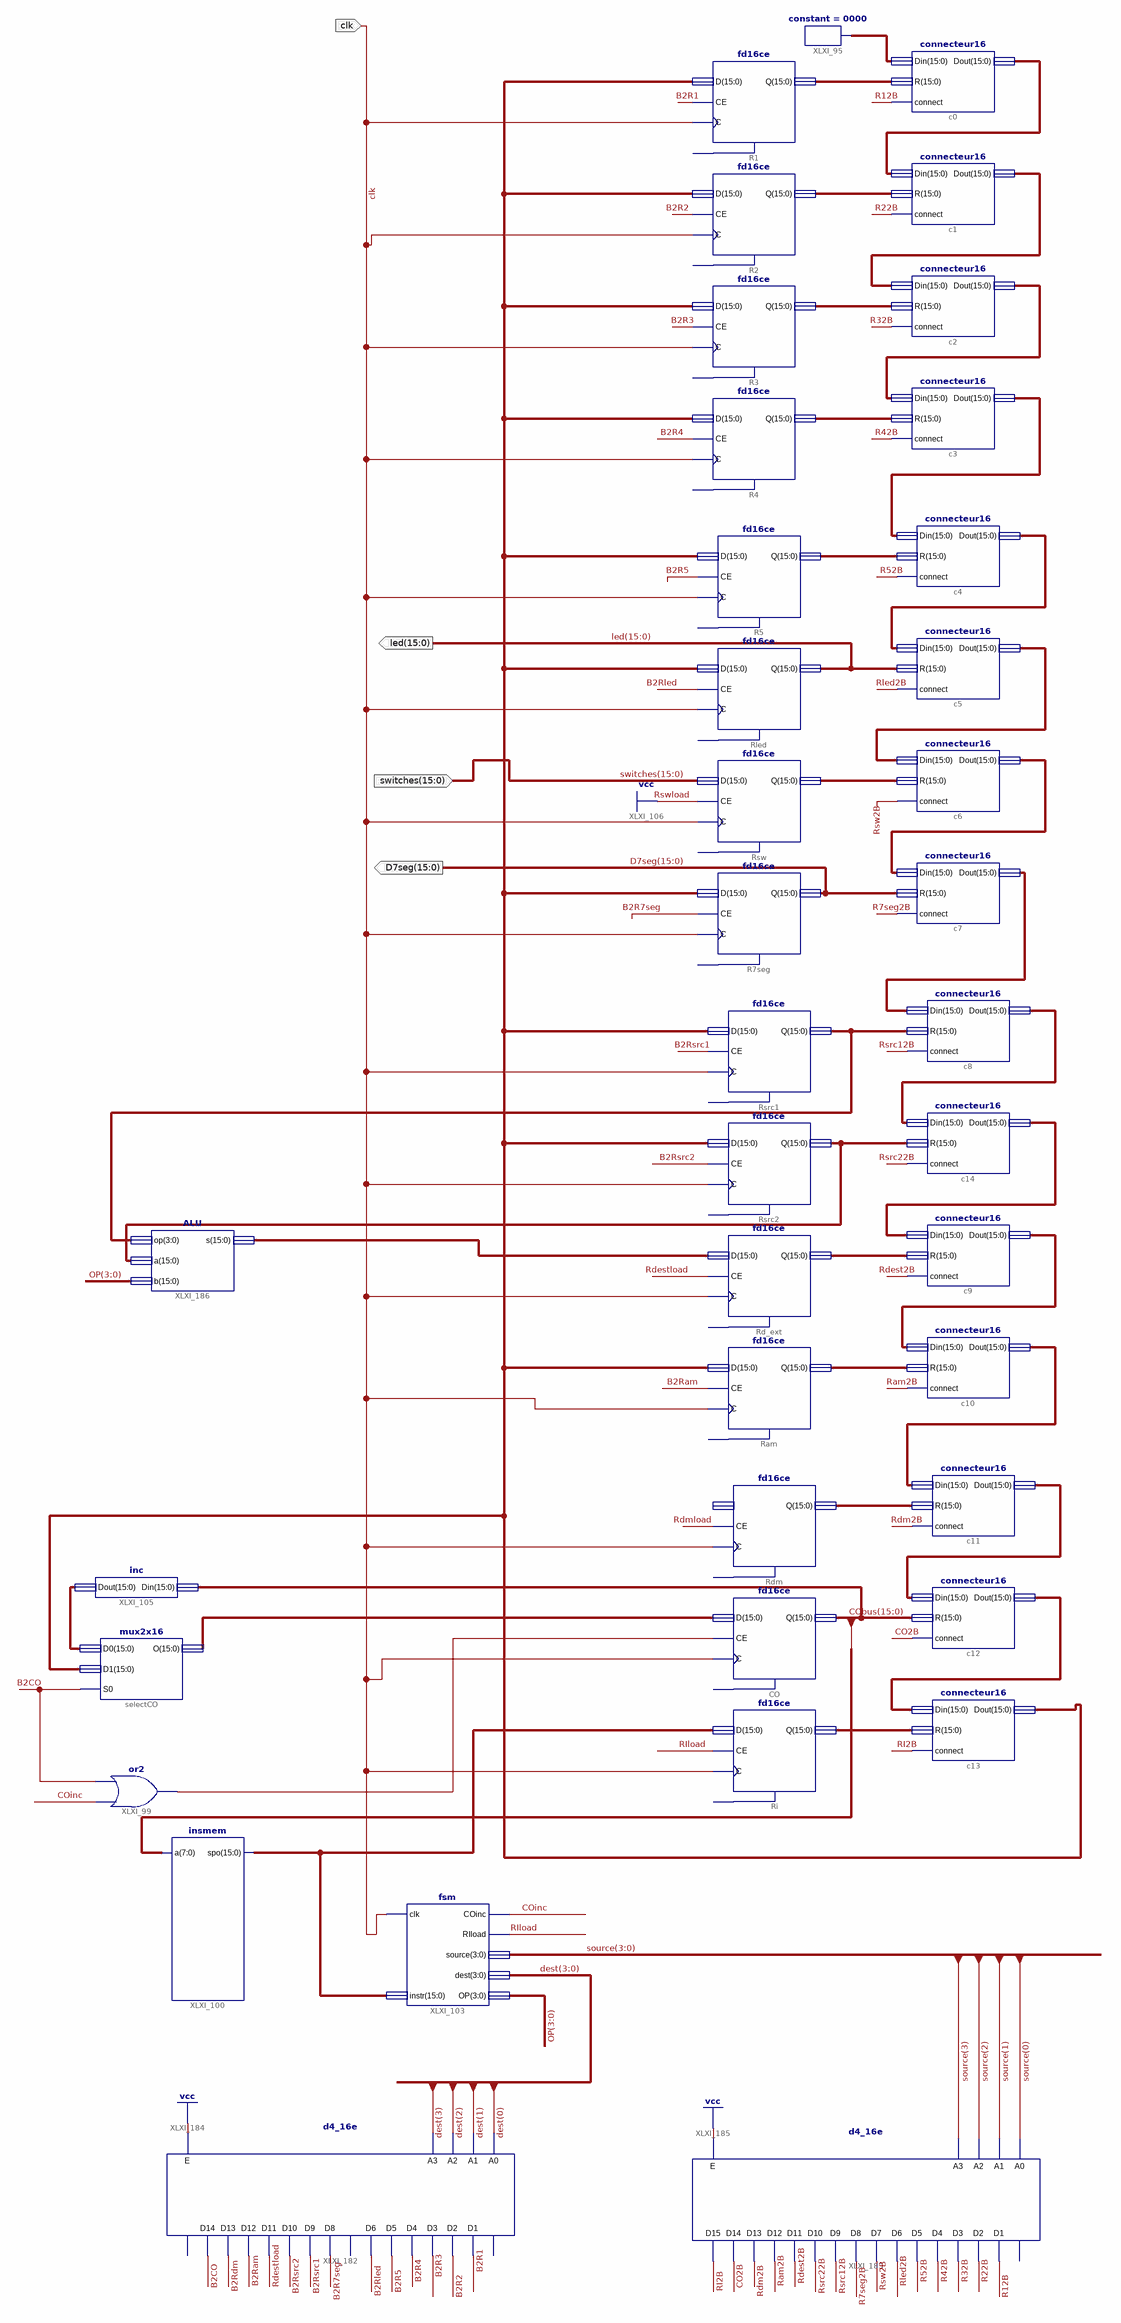
[diagram p0: schematic sheet 1]
// Xilinx ISE schematic S3.sch (spartan3e) as structural Verilog: 39 symbols, 4 ports
module S3 (
  input  [15:0] switches,
  input  clk,
  output [15:0] led,
  output [15:0] D7seg
);

  wire B2CO, B2R1, B2R2, B2R3, B2R4, B2R5, B2R7seg, B2Ram, B2Rdm, B2Rled, B2Rsrc1, B2Rsrc2, CO2B, COinc,
       R7seg2B, R12B, R22B, R32B, R42B, R52B, Ram2B, Rdest2B, Rdestload, Rdm2B, Rdmload, RI2B, RIload,
       Rled2B, Rsrc12B, Rsrc22B, Rsw2B, XLXN_133;
  wire [3:0] dest, OP, source;
  wire [15:0] CObus, R3out, R4out2, R7segout2, Rdextout2, Rdmout, Rsrc1out2, Rsrc2out, XLXN_1, XLXN_3,
       XLXN_5, XLXN_8, XLXN_10, XLXN_13, XLXN_15, XLXN_19, XLXN_21, XLXN_25, XLXN_27, XLXN_33, XLXN_34,
       XLXN_36, XLXN_40, XLXN_48, XLXN_51, XLXN_54, XLXN_57, XLXN_115, XLXN_119, XLXN_131, XLXN_134,
       XLXN_666, XLXN_863;

  fd16ce R1 (.C(clk), .CE(B2R1), .D(XLXN_119), .Q(XLXN_1));  // open: CLR
  connecteur16 c0 (.Din(XLXN_115), .R(XLXN_1), .connect(R12B), .Dout(XLXN_5));
  fd16ce R2 (.C(clk), .CE(B2R2), .D(XLXN_119), .Q(XLXN_3));  // open: CLR
  connecteur16 c1 (.Din(XLXN_5), .R(XLXN_3), .connect(R22B), .Dout(XLXN_13));
  fd16ce R3 (.C(clk), .CE(B2R3), .D(XLXN_119), .Q(R3out));  // open: CLR
  connecteur16 c2 (.Din(XLXN_13), .R(R3out), .connect(R32B), .Dout(XLXN_10));
  fd16ce R4 (.C(clk), .CE(B2R4), .D(XLXN_119), .Q(XLXN_8));  // open: CLR
  connecteur16 c3 (.Din(XLXN_10), .R(XLXN_8), .connect(R42B), .Dout(R4out2));
  fd16ce R5 (.C(clk), .CE(B2R5), .D(XLXN_119), .Q(XLXN_15));  // open: CLR
  connecteur16 c4 (.Din(R4out2), .R(XLXN_15), .connect(R52B), .Dout(XLXN_19));
  fd16ce Rled (.C(clk), .CE(B2Rled), .D(XLXN_119), .Q(led));  // open: CLR
  connecteur16 c5 (.Din(XLXN_19), .R(led), .connect(Rled2B), .Dout(XLXN_27));
  fd16ce Rsw (.C(clk), .CE(1'b1), .D(switches), .Q(XLXN_21));  // open: CLR
  connecteur16 c6 (.Din(XLXN_27), .R(XLXN_21), .connect(Rsw2B), .Dout(XLXN_25));
  fd16ce R7seg (.C(clk), .CE(B2R7seg), .D(XLXN_119), .Q(D7seg));  // open: CLR
  connecteur16 c7 (.Din(XLXN_25), .R(D7seg), .connect(R7seg2B), .Dout(R7segout2));
  fd16ce Rsrc1 (.C(clk), .CE(B2Rsrc1), .D(XLXN_119), .Q(XLXN_33));  // open: CLR
  connecteur16 c8 (.Din(R7segout2), .R(XLXN_33), .connect(Rsrc12B), .Dout(Rsrc1out2));
  fd16ce Rsrc2 (.C(clk), .CE(B2Rsrc2), .D(XLXN_119), .Q(Rsrc2out));  // open: CLR
  connecteur16 c14 (.Din(Rsrc1out2), .R(Rsrc2out), .connect(Rsrc22B), .Dout(XLXN_40));
  fd16ce Rd_ext (.C(clk), .CE(Rdestload), .D(XLXN_863), .Q(XLXN_34));  // open: CLR
  connecteur16 c9 (.Din(XLXN_40), .R(XLXN_34), .connect(Rdest2B), .Dout(Rdextout2));
  fd16ce Ram (.C(clk), .CE(B2Ram), .D(XLXN_119), .Q(XLXN_36));  // open: CLR
  connecteur16 c10 (.Din(Rdextout2), .R(XLXN_36), .connect(Ram2B), .Dout(XLXN_57));
  fd16ce Rdm (.C(clk), .CE(Rdmload), .Q(Rdmout));  // open: CLR, D
  connecteur16 c11 (.Din(XLXN_57), .R(Rdmout), .connect(Rdm2B), .Dout(XLXN_51));
  fd16ce CO (.C(clk), .CE(XLXN_133), .D(XLXN_131), .Q(CObus));  // open: CLR
  connecteur16 c12 (.Din(XLXN_51), .R(CObus), .connect(CO2B), .Dout(XLXN_54));
  fd16ce Ri (.C(clk), .CE(RIload), .D(XLXN_134), .Q(XLXN_48));  // open: CLR
  connecteur16 c13 (.Din(XLXN_54), .R(XLXN_48), .connect(RI2B), .Dout(XLXN_119));
  constant #(.CValue("0000")) XLXI_95 (.O(XLXN_115));
  mux2x16 selectCO (.D0(XLXN_666), .D1(XLXN_119), .S0(B2CO), .O(XLXN_131));
  or XLXI_99 (XLXN_133, COinc, B2CO);
  insmem XLXI_100 (.a(CObus[7:0]), .spo(XLXN_134));
  inc XLXI_105 (.Din(CObus), .Dout(XLXN_666));
  fsm XLXI_103 (.clk(clk), .instr(XLXN_134), .COinc(COinc), .RIload(RIload), .source(source), .dest(dest), .OP(OP));
  d4_16e XLXI_182 (
    .A0(dest[0]), .A1(dest[1]), .A2(dest[2]), .A3(dest[3]), .E(1'b1), .D1(B2R1), .D10(B2Rsrc2),
    .D11(Rdestload), .D12(B2Ram), .D13(B2Rdm), .D14(B2CO), .D2(B2R2), .D3(B2R3), .D4(B2R4), .D5(B2R5),
    .D6(B2Rled), .D8(B2R7seg), .D9(B2Rsrc1));  // open: D0, D15, D7
  d4_16e XLXI_183 (
    .A0(source[0]), .A1(source[1]), .A2(source[2]), .A3(source[3]), .E(1'b1), .D1(R12B), .D10(Rsrc22B),
    .D11(Rdest2B), .D12(Ram2B), .D13(Rdm2B), .D14(CO2B), .D15(RI2B), .D2(R22B), .D3(R32B), .D4(R42B),
    .D5(R52B), .D6(Rled2B), .D7(Rsw2B), .D8(R7seg2B), .D9(Rsrc12B));  // open: D0
  ALU XLXI_186 (.op(XLXN_33), .a(Rsrc2out), .b(OP), .s(XLXN_863));
endmodule
